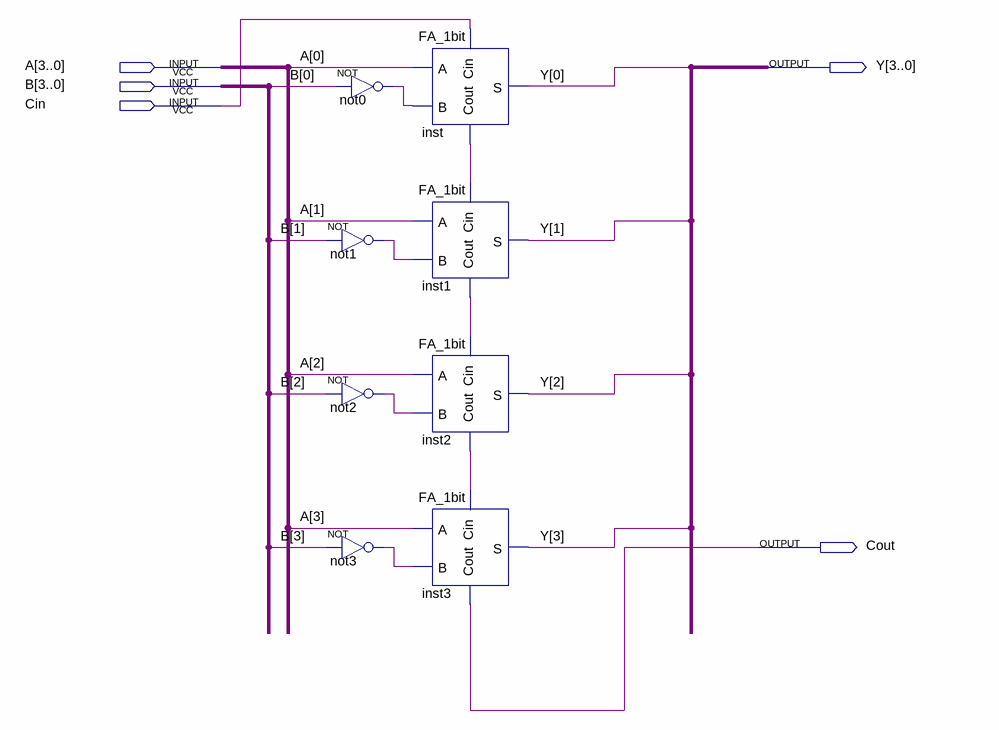
[diagram p0: schematic sheet]
// Quartus schematic Sub_4bits.bdf as structural Verilog: 8 symbols, 5 pins
module Sub_4bits (
  input  [3:0] A,
  input  [3:0] B,
  input  Cin,
  output [3:0] Y,
  output Cout
);

  wire inst1_cout, inst2_cout, inst_cout, not0_out, not1_out, not2_out, not3_out;

  not not0 (not0_out, B[0]);
  not not1 (not1_out, B[1]);
  not not2 (not2_out, B[2]);
  not not3 (not3_out, B[3]);
  FA_1bit inst (.A(A[0]), .B(not0_out), .Cin(Cin), .S(Y[0]), .Cout(inst_cout));
  FA_1bit inst1 (.A(A[1]), .B(not1_out), .Cin(inst_cout), .S(Y[1]), .Cout(inst1_cout));
  FA_1bit inst2 (.A(A[2]), .B(not2_out), .Cin(inst1_cout), .S(Y[2]), .Cout(inst2_cout));
  FA_1bit inst3 (.A(A[3]), .B(not3_out), .Cin(inst2_cout), .S(Y[3]), .Cout(Cout));
endmodule
